# EAGLE design ShineSensor (EAGLE 9.1.0)
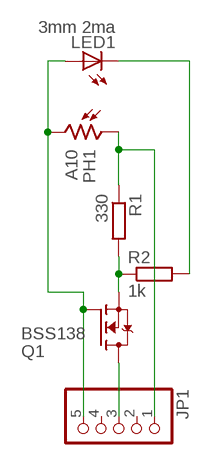
[diagram p0: schematic, sheet 1]

## Parts
JP1  PINHD-1X5  [1X05]
LED1  3mm 2ma  TLLY4400  [LED3MM]
PH1  A10  A1050_11  [T0-46-A10XX]
Q1  BSS138  [SOT23]
R1  330  R-EU_R1206  [R1206]
R2  1k  R-EU_R1206  [R1206]

## Nets
N$1: JP1.5 LED1.A PH1.2 Q1.1(G)
N$2: LED1.K(C) R2.2
N$3: JP1.3 Q1.3(D)
N$13: JP1.1 PH1.1 R1.1
N$14: Q1.2(S) R1.2 R2.1
Unconnected: JP1.2 JP1.4

## Library data of the parts
JP1 = pinhead:PINHD-1X5: PIN HEADER
LED1 = led:TLLY4400: Low Current (2mA) LED 3 mm Tinted Diffused Package color YELLOW Source: Data sheet <http://www.farnell.com/datasheets/391098.pdf>; MF: VISHAY SEMICONDUCTOR; OC_FARNELL: 1612439
PH1 = photo-elements:A10: Sensor Robust Light Sensing Applications Outdoor Light Sensing Application Source: http://optoelectronics.perkinelmer.com/content/Datasheets/DTS_PhotocellsA1050.pdf
Q1 = Cing Library:BSS138: BSS138 N-Channel Logic Level Enhancement Mode Field Effect Transistor Source: http://www.fairchildsemi.com/datasheets/BS/BSS138.pdf; MF: Fairchild; MPN: BSS138; OC_FARNELL: 9845330; OC_NEWARK: 67R2009
R1 R2 = rcl:R-EU_: RESISTOR, European symbol; SPICEPREFIX: R

## Board
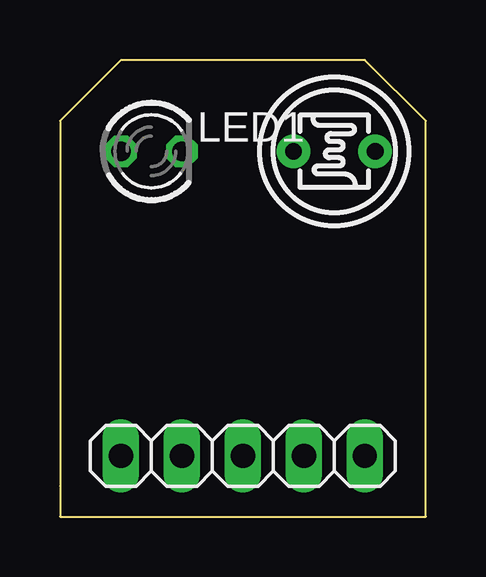
[diagram p1: board, top side]
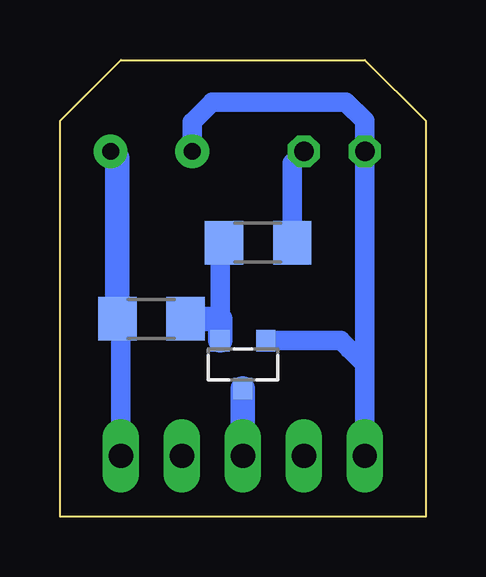
[diagram p2: board, bottom side, seen from below]

Size 15.24 x 19.05 mm. Coordinates in mm from the lower left corner, seen from the top.
Outline: 15.24,16.51 12.7,19.05 2.54,19.05 0,16.51 0,1.27 0,0 15.24,0 15.24,16.51
Copper layers (1*16): Top 0.035mm / dielectric 1.5mm / Bottom 0.035mm
Design rules "default": minimum track width 10mil, minimum drill 24mil, track to track 8mil, track to pad 8mil, pad to pad 8mil, via to via 8mil, smd to smd 8mil, copper to edge 40mil, drill to drill 8mil, minimum pad ring 10mil, minimum via ring 8mil, stop-mask expansion 4mil, vias tented up to drill 0mil, thermal gap 10mil

### Footprints (pad centres in the part's own frame; a part is rotated, then mirrored left to right if it is on the bottom)
1X05 = drill 1.016 long: 1 -5.08,0; 2 -2.54,0; 3 0,0; 4 2.54,0; 5 5.08,0
LED3MM = drill 0.813 octagon: A -1.27,0; K 1.27,0
T0-46-A10XX = drill 0.7 pad 1.4: 1 -1.7,0; 2 1.7,0
SOT23 = smd 0.8 x 0.9: 1 -0.95,-1; 2 0.95,-1; 3 0,1
R1206 = smd 1.6 x 1.803: 1 -1.422,0; 2 1.422,0

### Placement (x,y rotation side)
JP1  7.62,2.54 180 top
LED1  3.81,15.24 0 top
PH1  11.43,15.24 180 top
Q1  7.62,6.35 180 bottom
R1  11.43,8.26 0 bottom
R2  6.99,11.43 0 bottom

### Tracks (layer width: path | path; a pad name or v marks a point on that pad's centre or on a via)
N$1
  Bottom 0.813: Q1.1 3.54,7.35 2.54,6.35 | 2.54,6.35 2.54,5.08 | 2.54,5.08 JP1.5 | 3.19,7 2.54,6.35 | PH1.2 9.73,16.46 8.89,17.3 3.33,17.3 2.54,16.51 LED1.A 2.54,5.08
N$2
  Bottom 0.813: LED1.K 5.56,14.76 R2.2
N$3
  Bottom 1.016: Q1.3 JP1.3
N$13
  Bottom 0.813: R1.1 arc90 12.7,8.1 JP1.1
  Bottom 1.016: R1.1 12.85,14.96 PH1.1
N$14
  Bottom 0.813: R2.1 8.57,11.27 8.57,8.26
  Bottom 1.016: Q1.2 8.57,8.26 R1.2